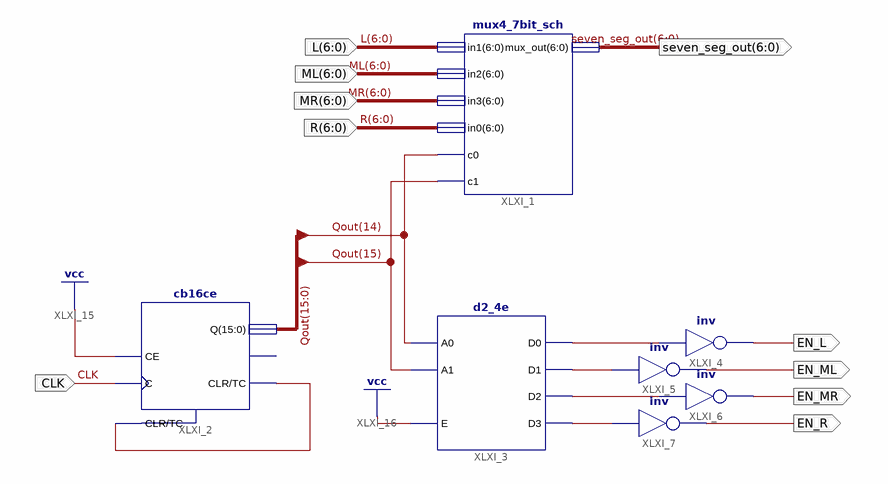
[diagram p0: schematic sheet 1]
// Xilinx ISE schematic seven_seg_control_sch.sch (spartan3e) as structural Verilog: 7 symbols, 10 ports
module seven_seg_control_sch (
  input  CLK,
  input  [6:0] L,
  input  [6:0] ML,
  input  [6:0] MR,
  input  [6:0] R,
  output EN_MR,
  output EN_L,
  output EN_ML,
  output EN_R,
  output [6:0] seven_seg_out
);

  wire XLXN_1, XLXN_2, XLXN_3, XLXN_4, XLXN_22;
  wire [15:0] Qout;

  cb16ce XLXI_2 (.C(CLK), .CE(1'b1), .CLR(XLXN_22), .Q(Qout), .TC(XLXN_22));  // open: CEO
  d2_4e XLXI_3 (.A0(Qout[14]), .A1(Qout[15]), .E(1'b1), .D0(XLXN_4), .D1(XLXN_3), .D2(XLXN_2), .D3(XLXN_1));
  not XLXI_5 (EN_ML, XLXN_3);
  not XLXI_6 (EN_MR, XLXN_2);
  not XLXI_7 (EN_R, XLXN_1);
  not XLXI_4 (EN_L, XLXN_4);
  mux4_7bit_sch XLXI_1 (.in1(L), .in2(ML), .in3(MR), .in0(R), .c0(Qout[14]), .c1(Qout[15]), .mux_out(seven_seg_out));
endmodule
